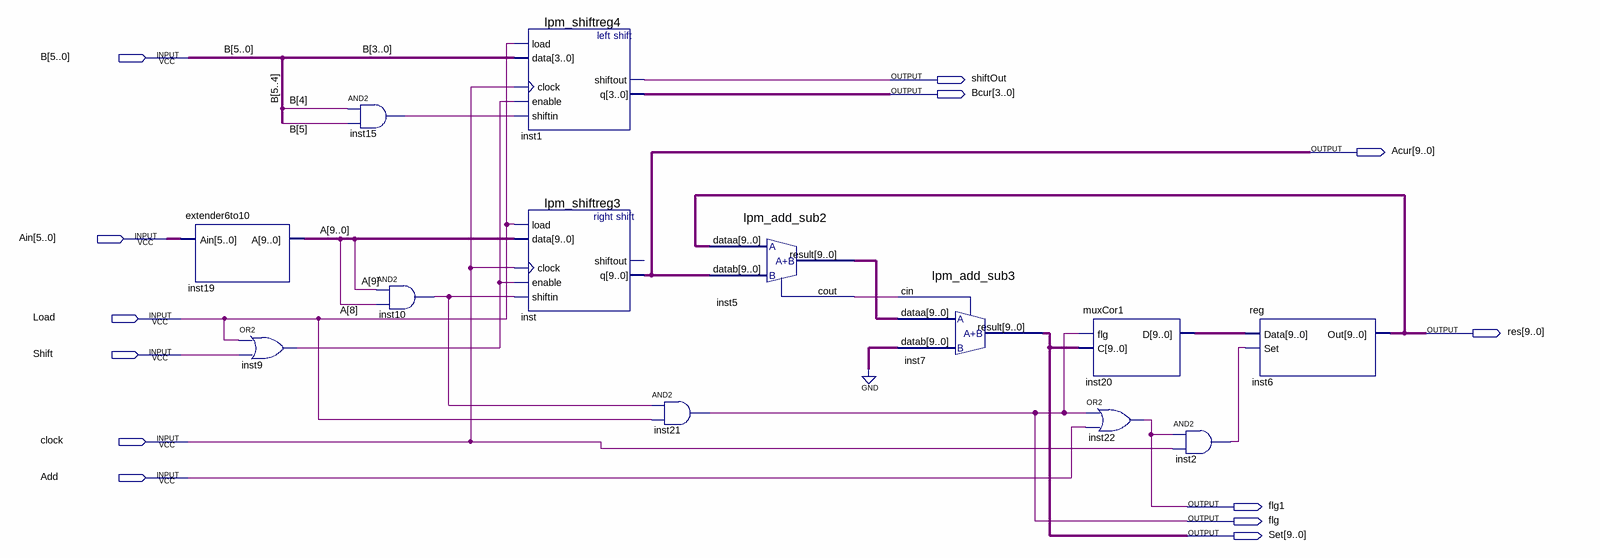
[diagram p0: schematic sheet]
// Quartus schematic main.bdf as structural Verilog: 13 symbols, 13 pins
module main (
  input  [5:0] B,
  input  [5:0] Ain,
  input  Load,
  input  Shift,
  input  clock,
  input  Add,
  output shiftOut,
  output [3:0] Bcur,
  output [9:0] Acur,
  output [9:0] res,
  output flg1,
  output flg,
  output [9:0] Set
);

  wire inst2_out, inst5_cout, inst9_out, inst10_out, inst15_out;
  wire [9:0] A, inst5_result, inst20_d;

  extender6to10 inst19 (.Ain(Ain), .A(A));
  or inst9 (inst9_out, Load, Shift);
  and inst15 (inst15_out, B[4], B[5]);
  and inst10 (inst10_out, A[9], A[8]);
  lpm_shiftreg4 inst1 (
    .load(Load), .data(B[3:0]), .clock(clock), .enable(inst9_out), .shiftin(inst15_out), .shiftout(shiftOut),
    .q(Bcur));
  lpm_shiftreg3 inst (
    .load(Load), .data(A), .clock(clock), .enable(inst9_out), .shiftin(inst10_out), .q(Acur));  // open: shiftout
  and inst21 (flg, inst10_out, Load);
  lpm_add_sub2 inst5 (.dataa(res), .datab(Acur), .result(inst5_result), .cout(inst5_cout));
  lpm_add_sub3 inst7 (.dataa(inst5_result), .datab({10{1'b0}}), .cin(inst5_cout), .result(Set));
  muxCor1 inst20 (.flg(flg), .C(Set), .D(inst20_d));
  or inst22 (flg1, flg, Add);
  and inst2 (inst2_out, flg1, clock);
  \reg  inst6 (.Data(inst20_d), .Set(inst2_out), .Out(res));
endmodule
